# EAGLE design 331811 (EAGLE 9.6.2)
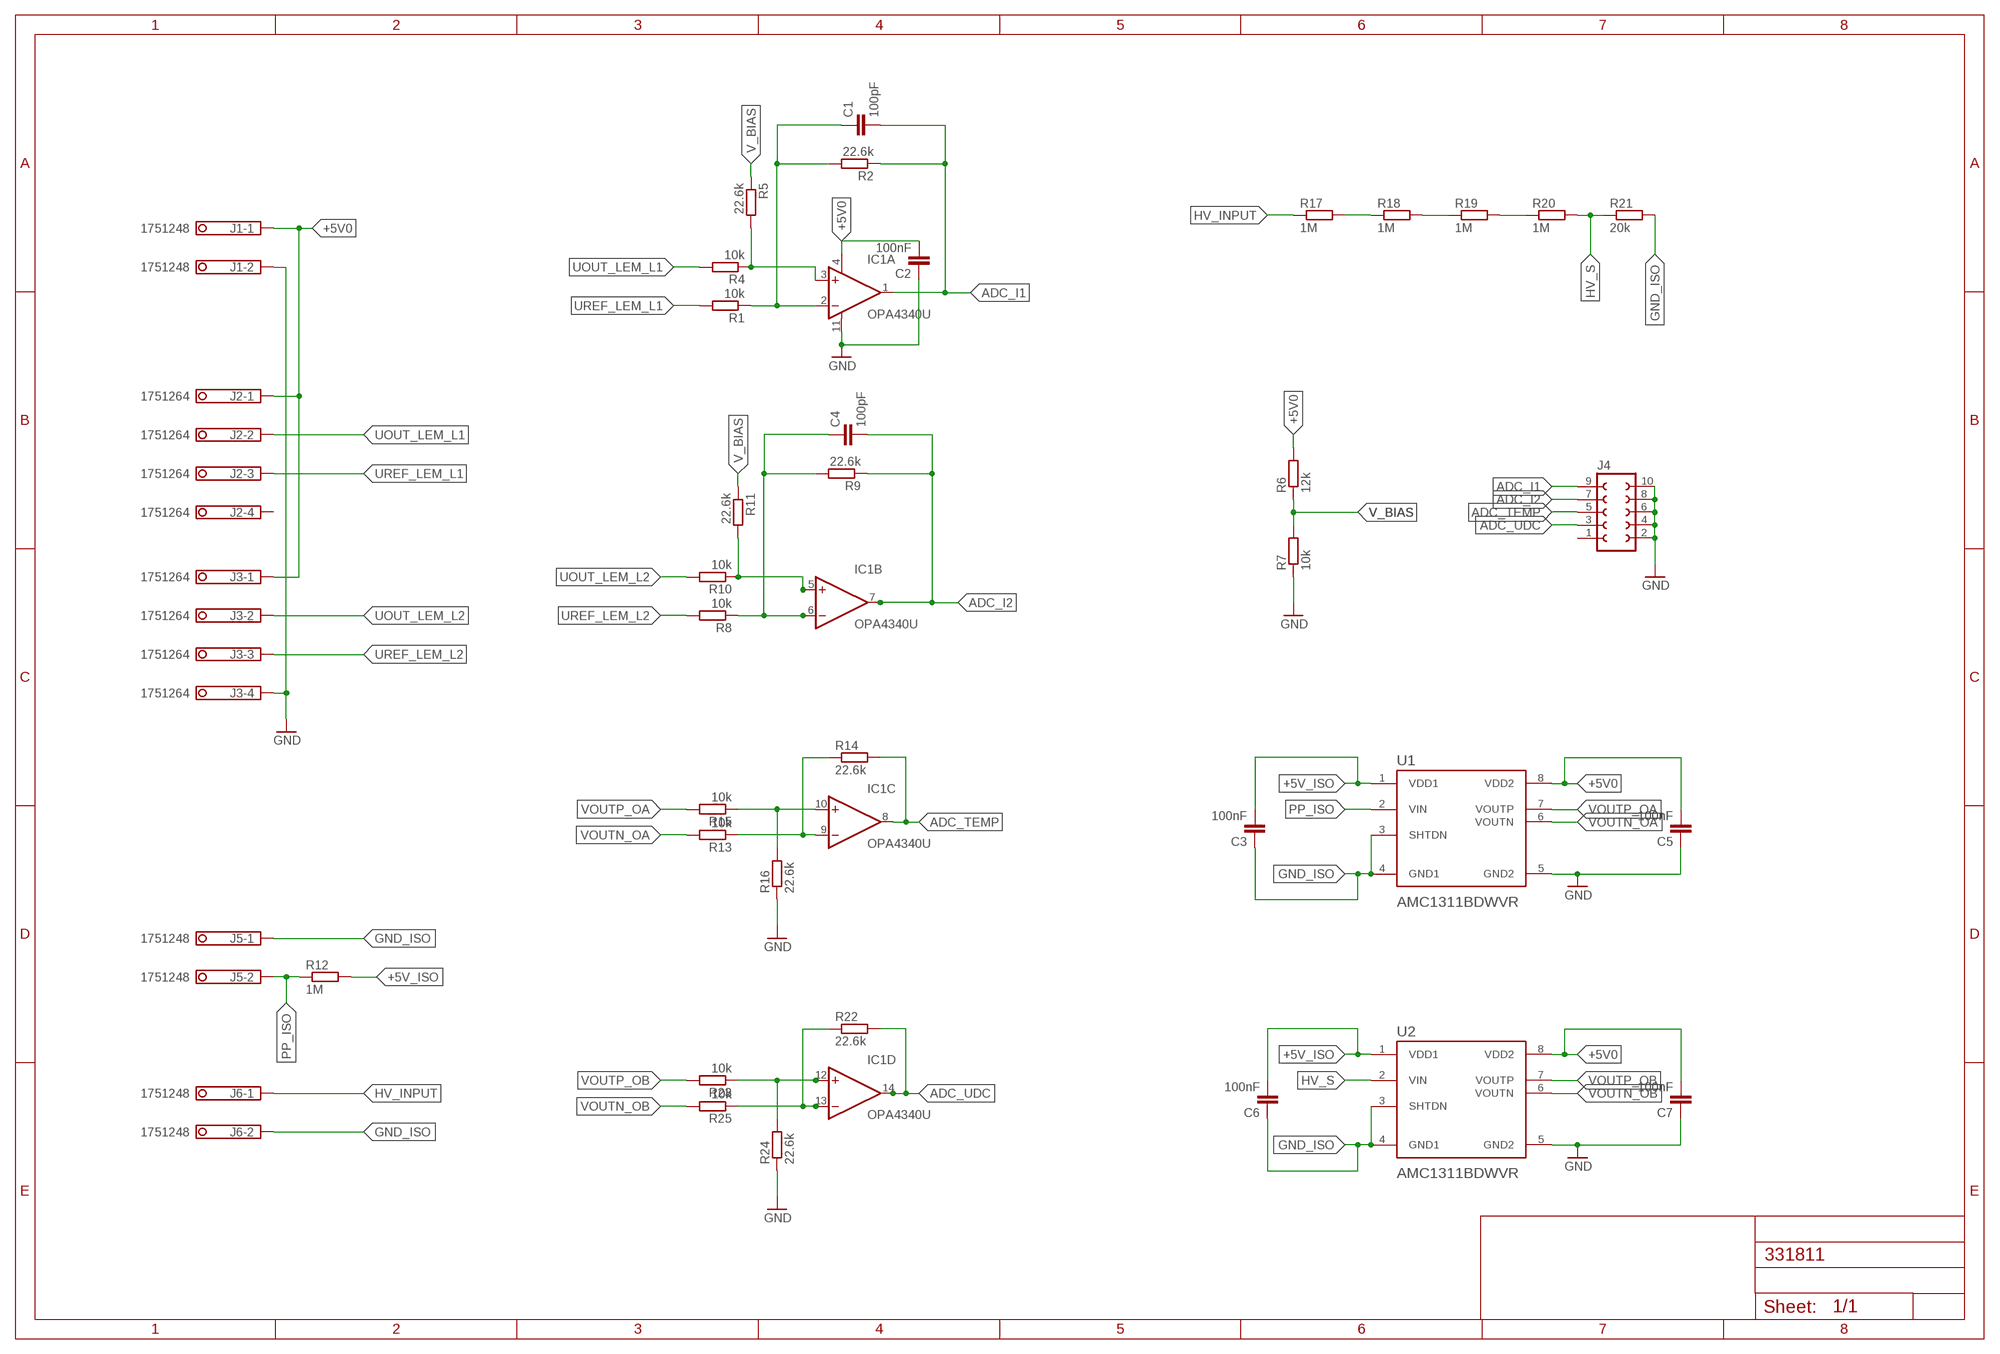
[diagram p0: schematic, sheet 1]

## Parts
C1  100pF  C-EUC0805  [C0805]
C2  100nF  C-EUC0805  [C0805]
C3  100nF  C-EUC0805  [C0805]
C4  100pF  C-EUC0805  [C0805]
C5  100nF  C-EUC0805  [C0805]
C6  100nF  C-EUC0805  [C0805]
C7  100nF  C-EUC0805  [C0805]
IC1  OPA4340U  [SO14]
J1  1751248  [1751248]
J2  1751264  [1751264]
J3  1751264  [1751264]
J4  FE05-2  [FE05-2]
J5  1751248  [1751248]
J6  1751248  [1751248]
R1  10k  R-EU_M1206  [M1206]
R2  22.6k  R-EU_M1206  [M1206]
R4  10k  R-EU_M1206  [M1206]
R5  22.6k  R-EU_M1206  [M1206]
R6  12k  R-EU_M1206  [M1206]
R7  10k  R-EU_M1206  [M1206]
R8  10k  R-EU_M1206  [M1206]
R9  22.6k  R-EU_M1206  [M1206]
R10  10k  R-EU_M1206  [M1206]
R11  22.6k  R-EU_M1206  [M1206]
R12  1M  R-EU_M1206  [M1206]
R13  10k  R-EU_M1206  [M1206]
R14  22.6k  R-EU_M1206  [M1206]
R15  10k  R-EU_M1206  [M1206]
R16  22.6k  R-EU_M1206  [M1206]
R17  1M  R-EU_M1206  [M1206]
R18  1M  R-EU_M1206  [M1206]
R19  1M  R-EU_M1206  [M1206]
R20  1M  R-EU_M1206  [M1206]
R21  20k  R-EU_M1206  [M1206]
R22  22.6k  R-EU_M1206  [M1206]
R23  10k  R-EU_M1206  [M1206]
R24  22.6k  R-EU_M1206  [M1206]
R25  10k  R-EU_M1206  [M1206]
U1  AMC1311BDWVR  [SOIC127P1150X280-8N]
U2  AMC1311BDWVR  [SOIC127P1150X280-8N]

## Nets
+5V0: C2.2 C5.2 C7.2 IC1.4(A:V+) J1.1 J2.1 J3.1 R6.2 U1.8(VDD2) U2.8(VDD2)
+5V_ISO: C3.2 C6.2 R12.2 U1.1(VDD1) U2.1(VDD1)
ADC_I1: C1.2 IC1.1(A:OUT) J4.9 R2.1
ADC_I2: C4.2 IC1.7(B:OUT) J4.7 R9.1
ADC_TEMP: IC1.8(C:OUT) J4.5 R14.2
ADC_UDC: IC1.14(D:OUT) J4.3 R22.2
GND: C2.1 C5.1 C7.1 IC1.11(A:V-) J1.2 J3.4 J4.2 J4.4 J4.6 J4.8 J4.10 R7.1 R16.1 R24.1 U1.5(GND2) U2.5(GND2)
GND_ISO: C3.1 C6.1 J5.1 J6.2 R21.2 U1.3(SHTDN) U1.4(GND1) U2.3(SHTDN) U2.4(GND1)
HV_INPUT: J6.1 R17.1
HV_S: R20.2 R21.1 U2.2(VIN)
N$1: C4.1 IC1.6(B:-IN) R8.1 R9.2
N$2: IC1.5(B:+IN) R10.1 R11.2
N$3: C1.1 IC1.2(A:-IN) R1.1 R2.2
N$4: R10.2
N$5: IC1.9(C:-IN) R13.1 R14.1
N$6: IC1.3(A:+IN) R4.1 R5.2
N$7: R4.2
N$8: IC1.10(C:+IN) R15.1 R16.2
N$9: R17.2 R18.1
N$10: R18.2 R19.1
N$11: R19.2 R20.1
N$13: IC1.13(D:-IN) R22.1 R25.1
N$14: IC1.12(D:+IN) R23.1 R24.2
PP_ISO: J5.2 R12.1 U1.2(VIN)
UOUT_LEM_L1: J2.2
UOUT_LEM_L2: J3.2
UREF_LEM_L1: J2.3 R1.2
UREF_LEM_L2: J3.3 R8.2
V_BIAS: R5.1 R6.1 R7.2 R11.1
VOUTN_OA: R13.2 U1.6(VOUTN)
VOUTN_OB: R25.2 U2.6(VOUTN)
VOUTP_OA: R15.2 U1.7(VOUTP)
VOUTP_OB: R23.2 U2.7(VOUTP)
Unconnected: J2.4 J4.1

## Library data of the parts
C1-C7 = rcl:C-EU: CAPACITOR, European symbol; SPICEPREFIX: C
IC1 = burr-brown:OPA4340: Operational Amplifiers Source: http://focus.ti.com/lit/ds/sbos073/sbos073.pdf; MF: TEXAS INSTRUMENTS; MPN: OPA4340UA; OC_FARNELL: 1212307; OC_NEWARK: 35C1907
J1 J5 J6 = con-phoenix-350:1751248: MKDS 1/ 2-3,5 Printklemme Nennstrom: 10 A Bemessungsspannung: 160 V Raster: 3,5 mm Polzahl: 2 Montageart: Löten Anschlussart: Schraubanschluss Anschlussrichtung vom Leiter zur Platine: 0° Source: http://eshop.phoenixcontact.com .. 1751248.pdf; OC_FARNELL: unknown; OC_NEWARK: unknown
J2 J3 = con-phoenix-350:1751264: MKDS 1/ 4-3,5 Printklemme Nennstrom: 10 A Bemessungsspannung: 160 V Raster: 3,5 mm Polzahl: 4 Montageart: Löten Anschlussart: Schraubanschluss Anschlussrichtung vom Leiter zur Platine: 0° Source: http://eshop.phoenixcontact.com .. 1751264.pdf; MPN: 1751264; OC_FARNELL: unknown; OC_NEWARK: 10R0934
J4 = con-lsta:FE05-2: FEMALE HEADER; OC_FARNELL: unknown; OC_NEWARK: unknown
R1 R2 R4-R25 = rcl:R-EU_: RESISTOR, European symbol; SPICEPREFIX: R
U1 U2 = AMC1311BDWVR:AMC1311BDWVR: Check availability <https://pricing.snapeda.com/parts/AMC1311BDWVR/Texas%20Instruments/view-part?ref=eda>; AVAILABILITY: In Stock; CHECK_PRICES: https://www.snapeda.com/parts/AMC1311BDWVR/Texas+Instruments/view-part/?ref=eda; DESCRIPTION: 2-V input, precision voltage sensing reinforced isolated amplifier; MF: Texas Instruments; MP: AMC1311BDWVR; PACKAGE: SOIC-8 Texas Instruments; PRICE: None; SNAPEDA_LINK: https://www.snapeda.com/parts/AMC1311BDWVR/Texas+Instruments/view-part/?ref=snap

## Board
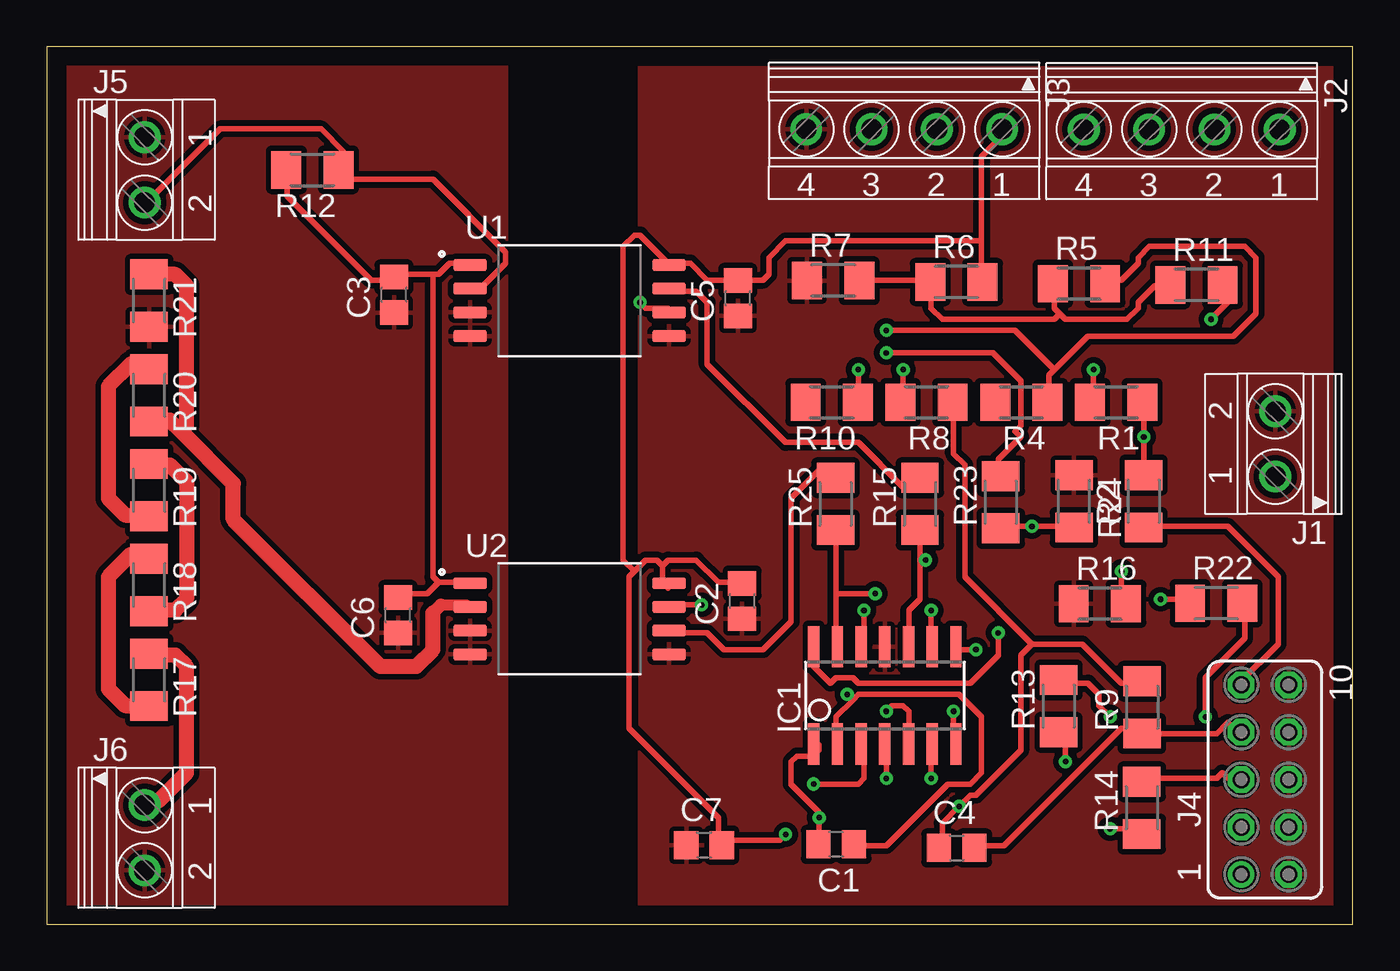
[diagram p1: board, top side]
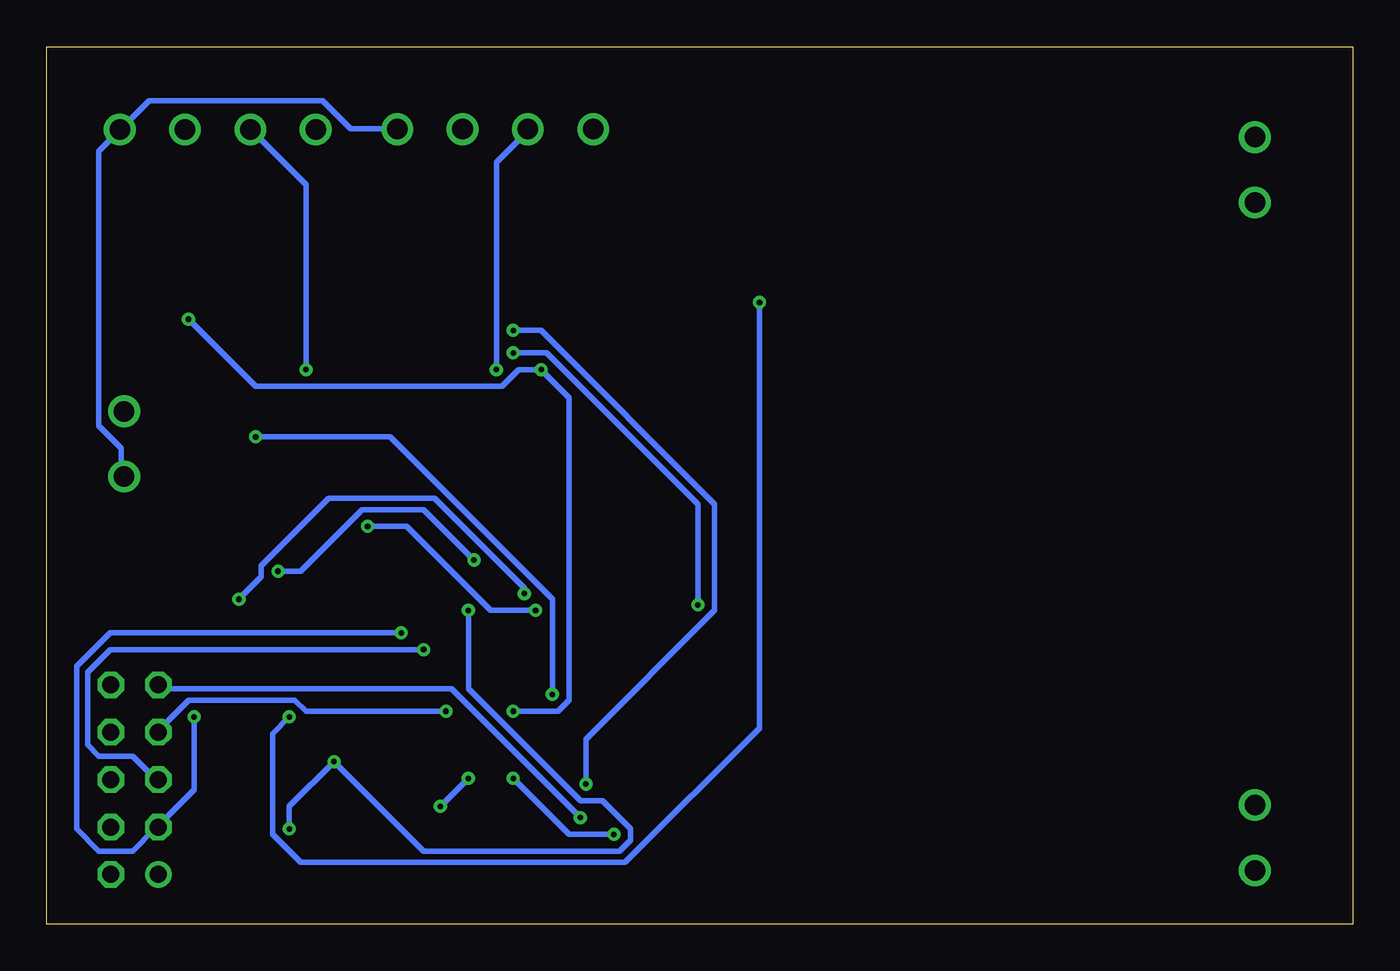
[diagram p2: board, bottom side, seen from below]

Size 70 x 47 mm. Coordinates in mm from the lower left corner, seen from the top.
Outline: 0,0 70,0 70,47 0,47 0,0
Copper layers (1*16): Top 0.035mm / dielectric 1.5mm / Bottom 0.035mm
Design rules "default *": minimum track width 0.3mm, minimum drill 0.3mm, track to track 0.3mm, track to pad 0.3mm, pad to pad 0.3mm, via to via 0.3mm, smd to smd 6mil, copper to edge 40mil, drill to drill 6mil, minimum pad ring 10mil, minimum via ring 8mil, stop-mask expansion 4mil, vias tented up to drill 0mil, thermal gap 10mil

### Footprints (pad centres in the part's own frame; a part is rotated, then mirrored left to right if it is on the bottom)
C0805 = smd 1.3 x 1.5: 1 -0.95,0; 2 0.95,0
SO14 = smd 0.61 x 2.21: 1 -3.81,-2.603; 2 -2.54,-2.603; 3 -1.27,-2.603; 4 0,-2.603; 5 1.27,-2.603; 6 2.54,-2.603; 7 3.81,-2.603; 8 3.81,2.603; 9 2.54,2.603; 10 1.27,2.603; 11 0,2.603; 12 -1.27,2.603; 13 -2.54,2.603; 14 -3.81,2.603
1751248 = drill 1.1 pad 1.7: 1 -1.75,-0.1; 2 1.75,-0.1
1751264 = drill 1.1 pad 1.7: 1 -5.25,-0.1; 2 -1.75,-0.1; 3 1.75,-0.1; 4 5.25,-0.1
FE05-2 = drill 0.914: 1 -5.08,1.27 | drill 0.914 octagon: 2 -5.08,-1.27; 3 -2.54,1.27; 4 -2.54,-1.27; 5 0,1.27; 6 0,-1.27; 7 2.54,1.27; 8 2.54,-1.27; 9 5.08,1.27; 10 5.08,-1.27
M1206 = smd 1.6 x 2: 1 -1.4,0; 2 1.4,0
SOIC127P1150X280-8N = smd 1.8 x 0.6: 1 -5.33,1.905; 2 -5.33,0.635; 3 -5.33,-0.635; 4 -5.33,-1.905; 5 5.33,-1.905; 6 5.33,-0.635; 7 5.33,0.635; 8 5.33,1.905

### Placement (x,y rotation side)
C1  42.32,4.27 180 top
C2  37.27,17.3 90 top
C3  18.61,33.71 90 top
C4  48.77,4.08 0 top
C5  37.04,33.52 90 top
C6  18.83,16.55 90 top
C7  35.23,4.23 0 top
IC1  44.92,12.24 0 top
J1  65.75,25.72 90 top
J2  60.83,42.47 180 top
J3  45.96,42.48 180 top
J4  65.29,7.73 90 top
J5  5.35,40.4 270 top
J6  5.35,4.62 270 top
R1  57.32,27.95 180 top
R2  58.79,22.64 90 top
R4  52.24,27.95 180 top
R5  55.32,34.3 0 top
R6  48.76,34.39 0 top
R7  42.15,34.47 0 top
R8  47.16,27.95 180 top
R9  58.7,11.61 90 top
R10  42.08,27.95 180 top
R11  61.62,34.24 0 top
R12  14.24,40.4 180 top
R13  54.23,11.67 90 top
R14  58.69,6.22 90 top
R15  46.8,22.5 90 top
R16  56.44,17.16 0 top
R17  5.49,13.08 270 top
R18  5.49,18.16 270 top
R19  5.49,23.24 270 top
R20  5.49,28.32 270 top
R21  5.49,33.4 270 top
R22  62.67,17.18 0 top
R23  51.13,22.59 90 top
R24  55.05,22.64 270 top
R25  42.28,22.5 90 top
U1  28.02,33.4 0 top
U2  28.02,16.35 0 top

### Tracks (layer width: path | path; a pad name or v marks a point on that pad's centre or on a via)
+5V0  (via drill 0.3)
  Top 0.3: 50.1,36.6 50.1,41.1 51.3,42.3 J3.1 | 50.1,36.6 50.1,34.5 R6.2 | 31.5,18.9 32.1,19.5 32.7,19.5 33,19.2 | 31.5,18.9 31.2,18.6 31.2,10.5 36,5.7 36,4.5 C7.2 36.3,4.5 39.3,4.5 v39.6,4.8 | 33,19.2 33,18.3 33.3,18 U2.8 | 33,19.2 33.3,19.5 34.8,19.5 36,18.3 37.2,18.3 C2.2 | v45,7.8 45,9.6 IC1.4 | 31.5,18.9 30.9,19.5 30.9,36.3 31.5,36.9 31.8,36.9 33.3,35.4 U1.8 33.6,35.4 34.5,35.4 35.4,34.5 36.9,34.5 C5.2 37.2,34.5 38.4,34.5 38.7,34.8 38.7,35.7 39.6,36.6 50.1,36.6
  Bottom 0.3: J1.1 66,24 66,25.5 67.2,26.7 67.2,41.4 66.3,42.3 J2.1 66,42.6 64.5,44.1 55.2,44.1 53.7,42.6 51.3,42.6 J3.1 | v45,7.8 42,4.8 v39.6,4.8
+5V_ISO
  Top 0.3: 21,18.3 20.4,17.7 18.9,17.7 C6.2 | 21,18.3 22.5,18.3 U2.1 | 20.7,34.8 21,34.8 21.6,35.4 22.5,35.4 U1.1 | 20.7,34.8 18.9,34.8 C3.2 18.6,34.5 17.4,34.5 12.9,39 12.9,40.2 R12.2 | 21,18.3 20.7,18.6 20.7,34.8
ADC_I1  (via drill 0.3)
  Top 0.3: C1.2 41.4,4.5 v41.4,5.7 41.4,6 39.9,7.5 39.9,8.7 40.2,9 41.1,9 41.4,9.3 41.4,9.6 IC1.1 | R2.1 58.8,21.3 63.3,21.3 66,18.6 66,15 63.9,12.9 J4.9
  Bottom 0.3: v41.4,5.7 48.3,12.6 63.9,12.6 J4.9
ADC_I2  (via drill 0.3)
  Top 0.3: C4.2 49.8,4.2 51.3,4.2 57.6,10.5 58.5,10.5 R9.1 58.8,10.2 62.7,10.2 63.3,10.8 63.9,10.2 J4.7 | v48.6,11.4 48.6,9.9 IC1.7
  Bottom 0.3: v48.6,11.4 56.1,11.4 56.7,12 62.4,12 63.9,10.5 J4.7
ADC_TEMP  (via drill 0.3)
  Top 0.3: R14.2 58.8,7.8 62.7,7.8 63,8.1 63.3,7.8 63.9,7.8 J4.5 | v49.8,14.7 48.9,14.7 IC1.8
  Bottom 0.3: v49.8,14.7 66.6,14.7 67.8,13.5 67.8,9.6 67.2,9 65.4,9 64.2,7.8 J4.5
ADC_UDC  (via drill 0.3)
  Top 0.3: v62.1,11.1 62.1,13.2 64.2,15.3 64.2,17.1 R22.2 | v51,15.6 51,14.4 49.5,12.9 43.5,12.9 43.2,13.2 42.3,13.2 42,12.9 41.1,13.8 41.1,14.7 IC1.14
  Bottom 0.3: v62.1,11.1 62.1,7.2 63.9,5.4 J4.3 64.2,5.1 65.4,3.9 67.2,3.9 68.4,5.1 68.4,13.8 66.6,15.6 v51,15.6
GND
  pour Top: 31.75,46.48 31.75,0.25 69.22,0.25 69.47,0.51 69.47,46.48
GND_ISO
  pour Top: 0.76,0.13 0.76,46.61 24.64,46.61 24.64,0.13
HV_INPUT
  Top 0.3: 5.7,14.4 R17.1
  Top 0.8: 5.7,14.4 6.9,14.4 7.5,13.8 7.5,8.1 6,6.6 5.4,6.6 J6.1
HV_S
  Top 0.3: 22.5,17.1 U2.2 | 5.7,27 R20.2 | 7.2,26.4 7.5,26.7
  Top 0.6: 21.13,17.1 22.5,17.1
  Top 0.7: 20.7,16.67 21.13,17.1
  Top 0.8: 20.7,16.67 20.7,14.7 19.8,13.8 17.87,13.8 10.01,21.67 10.01,23.59 7.2,26.4 6.6,27 5.7,27 | R21.1 6.9,34.8 7.5,34.2 7.5,26.7
N$1  (via drill 0.3)
  Top 0.3: 52.8,15 52.2,14.4 52.2,9.3 49.8,6.9 49.5,6.9 v48.9,6.3 48,5.4 48,4.2 C4.1 | 52.8,15 55.5,15 57.6,12.9 58.5,12.9 R9.2 | 52.8,15 49.2,18.6 49.2,24.6 48.6,25.2 48.6,27.9 R8.1 | v47.4,7.8 47.4,9.6 IC1.6
  Bottom 0.3: v48.9,6.3 v47.4,7.8
N$2  (via drill 0.3)
  Top 0.3: v43.5,29.7 43.5,28.2 R10.1 | v62.4,32.4 63.3,33.3 63.3,34.2 R11.2 | v45,11.4 45.3,11.7 45.9,11.7 46.2,11.4 46.2,9.9 IC1.5
  Bottom 0.3: v62.4,32.4 58.8,28.8 45.6,28.8 44.7,29.7 v43.5,29.7 42,28.2 42,12 42.6,11.4 v45,11.4
N$3  (via drill 0.3)
  Top 0.3: R2.2 58.8,24.3 v58.8,26.1 58.8,27.9 R1.1 | 43.2,12 42.3,11.1 42.3,9.9 IC1.2 | 43.2,12 43.5,12.3 48.9,12.3 50.1,11.1 50.1,8.1 49.5,7.5 48.3,7.5 45,4.2 43.5,4.2 C1.1 | 43.2,12 v42.9,12.3
  Bottom 0.3: v58.8,26.1 51.6,26.1 42.9,17.4 v42.9,12.3
N$5  (via drill 0.3)
  Top 0.3: v57,5.1 58.5,5.1 R14.1 | v54.6,8.7 54.6,9.9 54.3,10.2 R13.1 | v47.4,16.8 47.4,15 IC1.9
  Bottom 0.3: v57,5.1 57,6.3 v54.6,8.7 49.8,3.9 39.3,3.9 38.7,4.5 38.7,5.1 40.2,6.6 41.4,6.6 47.4,12.6 v47.4,16.8
N$6  (via drill 0.3)
  Top 0.3: 54,29.7 55.8,31.5 63.6,31.5 64.8,32.7 64.8,35.7 64.2,36.3 59.1,36.3 58.5,35.7 58.5,35.4 57.6,34.5 57,34.5 R5.2 | 54,29.7 53.7,29.4 53.7,28.2 R4.1 | v41.1,7.5 43.5,7.5 43.8,7.8 43.8,9.6 IC1.3 | v45,31.8 51.9,31.8 54,29.7
  Bottom 0.3: v41.1,7.5 41.1,9.9 34.2,16.8 34.2,22.5 43.5,31.8 v45,31.8
N$8  (via drill 0.3)
  Top 0.3: 46.8,19.5 46.8,17.4 46.2,16.8 46.2,15 IC1.10 | 46.8,19.5 46.8,21 R15.1 | v57.6,18.9 57.6,17.4 R16.2 | 46.8,19.5 v47.1,19.5
  Bottom 0.3: v57.6,18.9 56.4,18.9 53.1,22.2 49.8,22.2 v47.1,19.5
N$9
  Top 0.3: 4.5,19.8 5.4,19.8 R18.1 | 5.4,11.7 R17.2
  Top 0.8: 5.4,11.7 4.2,11.7 3.3,12.6 3.3,18.6 4.5,19.8
N$10
  Top 0.3: 5.7,16.8 R18.2 | 5.7,24.6 R19.1
  Top 0.8: 5.7,16.8 6.9,16.8 7.5,17.4 7.5,23.7 6.6,24.6 5.7,24.6
N$11
  Top 0.3: 5.4,21.9 R19.2 | 5.4,30 R20.1
  Top 0.8: 5.4,21.9 4.2,21.9 3.3,22.8 3.3,28.8 4.5,30 5.4,30
N$13  (via drill 0.3)
  Top 0.3: 42.3,17.7 42.3,15 IC1.13 | 42.3,17.7 42.3,21 R25.1 | v59.7,17.4 61.2,17.4 R22.1 | 42.3,17.7 v44.4,17.7
  Bottom 0.3: v59.7,17.4 58.5,18.6 58.5,19.2 54.9,22.8 49.2,22.8 44.4,18 v44.4,17.7
N$14  (via drill 0.3)
  Top 0.3: R23.1 51.3,21.3 v52.8,21.3 54.9,21.3 R24.2 | v43.8,16.8 43.8,15 IC1.12
  Bottom 0.3: v43.8,16.8 46.2,16.8 50.7,21.3 v52.8,21.3
PP_ISO
  Top 0.3: U1.2 22.8,34.2 23.4,34.2 24.6,35.4 24.6,36 20.7,39.9 16.2,39.9 15.9,40.2 R12.1 15.9,40.5 15.9,41.4 14.7,42.6 9.3,42.6 5.4,38.7 J5.2
UREF_LEM_L1  (via drill 0.3)
  Top 0.3: v56.1,29.7 56.1,28.2 R1.2
  Bottom 0.3: v56.1,29.7 56.1,39.6 58.8,42.3 J2.3
UREF_LEM_L2  (via drill 0.3)
  Top 0.3: v45.9,29.7 45.9,28.2 R8.2
  Bottom 0.3: v45.9,29.7 45.9,40.8 44.4,42.3 J3.3
V_BIAS
  Top 0.3: R7.2 43.8,34.5 47.1,34.5 R6.1 47.4,34.2 47.4,33 48,32.4 54,32.4 54.3,32.7 | 54.3,32.7 54.6,32.4 57.9,32.4 58.5,33 58.5,33.3 59.4,34.2 60,34.2 R11.1 | 54.3,32.7 54,33 54,34.2 R5.1
VOUTN_OA  (via drill 0.3)
  Top 0.3: v31.8,33.3 32.1,33 33.3,33 U1.6 | v57,11.1 56.4,11.7 56.4,12.3 55.8,12.9 54.3,12.9 R13.2
  Bottom 0.3: v31.8,33.3 31.8,10.5 39,3.3 56.4,3.3 57.9,4.8 57.9,10.2 v57,11.1
VOUTN_OB
  Top 0.3: U2.6 33.6,15.6 35.4,15.6 36.3,14.7 38.4,14.7 39.9,16.2 39.9,22.8 41.4,24.3 41.7,24.3 42,24 R25.2
VOUTP_OA
  Top 0.3: U1.7 33.6,33.9 34.8,33.9 35.4,33.3 35.4,30 39.6,25.8 43.5,25.8 45.9,23.4 46.2,23.4 46.5,23.7 R15.2
VOUTP_OB  (via drill 0.3)
  Top 0.3: v35.1,17.1 33.6,17.1 U2.7 | v45,30.6 50.7,30.6 52.2,29.1 52.2,26.7 51.9,26.4 52.2,26.1 51,24.9 51,24 R23.2
  Bottom 0.3: v35.1,17.1 35.1,22.5 43.2,30.6 v45,30.6